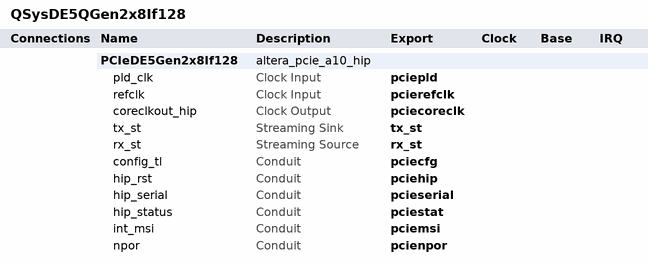
[diagram p0: system contents]
# Platform Designer (Qsys) system QSysDE5QGen2x8If128, Arria 10 10AX115N2F45E1SG
# Parameters at their usual value, and those the tool derives, are not listed.
package require -exact qsys 17.0
create_system QSysDE5QGen2x8If128
set_project_property DEVICE_FAMILY {Arria 10}
set_project_property DEVICE 10AX115N2F45E1SG

add_instance PCIeDE5Gen2x8If128 altera_pcie_a10_hip 17.0
set_instance_parameter_value PCIeDE5Gen2x8If128 adme_enable_hwtcl 0
set_instance_parameter_value PCIeDE5Gen2x8If128 advance_error_reporting_hwtcl 0
set_instance_parameter_value PCIeDE5Gen2x8If128 apps_type_hwtcl 0
set_instance_parameter_value PCIeDE5Gen2x8If128 ari_support_hwtcl 0
set_instance_parameter_value PCIeDE5Gen2x8If128 ast_trs_num_desc_hwtcl 16
set_instance_parameter_value PCIeDE5Gen2x8If128 ast_trs_rxdata_width_hwtcl 256
set_instance_parameter_value PCIeDE5Gen2x8If128 ast_trs_rxdesc_width_hwtcl 256
set_instance_parameter_value PCIeDE5Gen2x8If128 ast_trs_rxmty_width_hwtcl 32
set_instance_parameter_value PCIeDE5Gen2x8If128 ast_trs_txdata_width_hwtcl 256
set_instance_parameter_value PCIeDE5Gen2x8If128 ast_trs_txdesc_width_hwtcl 256
set_instance_parameter_value PCIeDE5Gen2x8If128 ast_trs_txmty_width_hwtcl 32
set_instance_parameter_value PCIeDE5Gen2x8If128 ast_trs_txstatus_width_hwtcl 256
set_instance_parameter_value PCIeDE5Gen2x8If128 avmm_addr_width_hwtcl 64
set_instance_parameter_value PCIeDE5Gen2x8If128 bar0_address_width_hwtcl 10
set_instance_parameter_value PCIeDE5Gen2x8If128 bar0_type_hwtcl {32-bit non-prefetchable memory}
set_instance_parameter_value PCIeDE5Gen2x8If128 bar1_address_width_hwtcl 0
set_instance_parameter_value PCIeDE5Gen2x8If128 bar1_type_hwtcl Disabled
set_instance_parameter_value PCIeDE5Gen2x8If128 bar2_address_width_hwtcl 8
set_instance_parameter_value PCIeDE5Gen2x8If128 bar2_type_hwtcl {64-bit prefetchable memory}
set_instance_parameter_value PCIeDE5Gen2x8If128 bar3_address_width_hwtcl 0
set_instance_parameter_value PCIeDE5Gen2x8If128 bar3_type_hwtcl Disabled
set_instance_parameter_value PCIeDE5Gen2x8If128 base_device NIGHTFURY5
set_instance_parameter_value PCIeDE5Gen2x8If128 bfm_drive_interface_clk_hwtcl 1
set_instance_parameter_value PCIeDE5Gen2x8If128 bfm_drive_interface_control_hwtcl 1
set_instance_parameter_value PCIeDE5Gen2x8If128 bfm_drive_interface_npor_hwtcl 1
set_instance_parameter_value PCIeDE5Gen2x8If128 bfm_drive_interface_pipe_hwtcl 1
set_instance_parameter_value PCIeDE5Gen2x8If128 cg_a2p_addr_map_pass_thru_bits_hwtcl 12
set_instance_parameter_value PCIeDE5Gen2x8If128 cg_enable_a2p_interrupt_hwtcl 0
set_instance_parameter_value PCIeDE5Gen2x8If128 cg_enable_advanced_interrupt_hwtcl 0
set_instance_parameter_value PCIeDE5Gen2x8If128 class_code_hwtcl 0
set_instance_parameter_value PCIeDE5Gen2x8If128 completion_timeout_hwtcl ABCD
set_instance_parameter_value PCIeDE5Gen2x8If128 cseb_autonomous_hwtcl 0
set_instance_parameter_value PCIeDE5Gen2x8If128 cseb_config_bypass_hwtcl 0
set_instance_parameter_value PCIeDE5Gen2x8If128 design_environment_hwtcl QSYS
set_instance_parameter_value PCIeDE5Gen2x8If128 devhide_support_hwtcl 0
set_instance_parameter_value PCIeDE5Gen2x8If128 device_embedded_ep_support_hwtcl 0
set_instance_parameter_value PCIeDE5Gen2x8If128 device_id_hwtcl 0
set_instance_parameter_value PCIeDE5Gen2x8If128 dis_adapt 0
set_instance_parameter_value PCIeDE5Gen2x8If128 dma_use_scfifo_ext_hwtcl 0
set_instance_parameter_value PCIeDE5Gen2x8If128 ecrc_check_capable_hwtcl 0
set_instance_parameter_value PCIeDE5Gen2x8If128 ecrc_gen_capable_hwtcl 0
set_instance_parameter_value PCIeDE5Gen2x8If128 enable_ast_trs_hwtcl 0
set_instance_parameter_value PCIeDE5Gen2x8If128 enable_avst_reset_hwtcl 0
set_instance_parameter_value PCIeDE5Gen2x8If128 enable_custom_features_hwtcl 0
set_instance_parameter_value PCIeDE5Gen2x8If128 enable_devkit_conduit_hwtcl 0
set_instance_parameter_value PCIeDE5Gen2x8If128 enable_example_design_qii_hwtcl 1
set_instance_parameter_value PCIeDE5Gen2x8If128 enable_example_design_sim_hwtcl 1
set_instance_parameter_value PCIeDE5Gen2x8If128 enable_example_design_synth_hwtcl 1
set_instance_parameter_value PCIeDE5Gen2x8If128 enable_example_design_tb_hwtcl 1
set_instance_parameter_value PCIeDE5Gen2x8If128 enable_gen3phase2eq_timechange 0
set_instance_parameter_value PCIeDE5Gen2x8If128 enable_hip_status_for_avmm_hwtcl 0
set_instance_parameter_value PCIeDE5Gen2x8If128 enable_lmi_hwtcl 1
set_instance_parameter_value PCIeDE5Gen2x8If128 enable_nobar_slection_hwtcl 0
set_instance_parameter_value PCIeDE5Gen2x8If128 enable_rxm_burst_hwtcl 0
set_instance_parameter_value PCIeDE5Gen2x8If128 enable_skp_det 0
set_instance_parameter_value PCIeDE5Gen2x8If128 enable_soft_dfe 0
set_instance_parameter_value PCIeDE5Gen2x8If128 export_fpll_output_to_top_level_hwtcl 0
set_instance_parameter_value PCIeDE5Gen2x8If128 export_phy_input_to_top_level_hwtcl 0
set_instance_parameter_value PCIeDE5Gen2x8If128 extended_tag_support_hwtcl 0
set_instance_parameter_value PCIeDE5Gen2x8If128 flr_capability_user_hwtcl 0
set_instance_parameter_value PCIeDE5Gen2x8If128 force_tag_checking_on_hwtcl 0
set_instance_parameter_value PCIeDE5Gen2x8If128 gen3_coeff_1_hwtcl 8
set_instance_parameter_value PCIeDE5Gen2x8If128 gen3_coeff_3_ber_meas_hwtcl 12ms
set_instance_parameter_value PCIeDE5Gen2x8If128 interface_type_hwtcl Avalon-ST
set_instance_parameter_value PCIeDE5Gen2x8If128 internal_controller_hwtcl 1
set_instance_parameter_value PCIeDE5Gen2x8If128 link2csr_width_hwtcl 16
set_instance_parameter_value PCIeDE5Gen2x8If128 maximum_payload_size_hwtcl 256
set_instance_parameter_value PCIeDE5Gen2x8If128 msi_multi_message_capable_hwtcl 1
set_instance_parameter_value PCIeDE5Gen2x8If128 part_trait_device 10AX115N2F45E1SG
set_instance_parameter_value PCIeDE5Gen2x8If128 pf0_ats_invalidate_queue_depth_hwtcl 0
set_instance_parameter_value PCIeDE5Gen2x8If128 pf0_bar0_prefetchable_hwtcl 1
set_instance_parameter_value PCIeDE5Gen2x8If128 pf0_bar0_present_hwtcl 1
set_instance_parameter_value PCIeDE5Gen2x8If128 pf0_bar0_size_hwtcl 12
set_instance_parameter_value PCIeDE5Gen2x8If128 pf0_bar0_type_hwtcl 1
set_instance_parameter_value PCIeDE5Gen2x8If128 pf0_bar1_prefetchable_hwtcl 1
set_instance_parameter_value PCIeDE5Gen2x8If128 pf0_bar1_present_hwtcl 0
set_instance_parameter_value PCIeDE5Gen2x8If128 pf0_bar1_size_hwtcl 12
set_instance_parameter_value PCIeDE5Gen2x8If128 pf0_bar2_prefetchable_hwtcl 1
set_instance_parameter_value PCIeDE5Gen2x8If128 pf0_bar2_present_hwtcl 0
set_instance_parameter_value PCIeDE5Gen2x8If128 pf0_bar2_size_hwtcl 12
set_instance_parameter_value PCIeDE5Gen2x8If128 pf0_bar2_type_hwtcl 1
set_instance_parameter_value PCIeDE5Gen2x8If128 pf0_bar3_prefetchable_hwtcl 1
set_instance_parameter_value PCIeDE5Gen2x8If128 pf0_bar3_present_hwtcl 0
set_instance_parameter_value PCIeDE5Gen2x8If128 pf0_bar3_size_hwtcl 12
set_instance_parameter_value PCIeDE5Gen2x8If128 pf0_bar4_prefetchable_hwtcl 1
set_instance_parameter_value PCIeDE5Gen2x8If128 pf0_bar4_present_hwtcl 0
set_instance_parameter_value PCIeDE5Gen2x8If128 pf0_bar4_size_hwtcl 12
set_instance_parameter_value PCIeDE5Gen2x8If128 pf0_bar4_type_hwtcl 1
set_instance_parameter_value PCIeDE5Gen2x8If128 pf0_bar5_prefetchable_hwtcl 1
set_instance_parameter_value PCIeDE5Gen2x8If128 pf0_bar5_present_hwtcl 0
set_instance_parameter_value PCIeDE5Gen2x8If128 pf0_bar5_size_hwtcl 12
set_instance_parameter_value PCIeDE5Gen2x8If128 pf0_exprom_bar_present_hwtcl 0
set_instance_parameter_value PCIeDE5Gen2x8If128 pf0_exprom_bar_size_hwtcl 12
set_instance_parameter_value PCIeDE5Gen2x8If128 pf0_extra_bar_present_hwtcl 0
set_instance_parameter_value PCIeDE5Gen2x8If128 pf0_extra_bar_size_hwtcl 12
set_instance_parameter_value PCIeDE5Gen2x8If128 pf0_interrupt_pin_hwtcl inta
set_instance_parameter_value PCIeDE5Gen2x8If128 pf0_intr_line_hwtcl 0
set_instance_parameter_value PCIeDE5Gen2x8If128 pf0_msi_multi_message_capable_hwtcl 4
set_instance_parameter_value PCIeDE5Gen2x8If128 pf0_msix_pba_bir_hwtcl 0
set_instance_parameter_value PCIeDE5Gen2x8If128 pf0_msix_pba_offset_hwtcl 0
set_instance_parameter_value PCIeDE5Gen2x8If128 pf0_msix_table_bir_hwtcl 0
set_instance_parameter_value PCIeDE5Gen2x8If128 pf0_msix_table_offset_hwtcl 0
set_instance_parameter_value PCIeDE5Gen2x8If128 pf0_msix_table_size_hwtcl 0
set_instance_parameter_value PCIeDE5Gen2x8If128 pf0_pci_prog_intfc_byte_hwtcl 0
set_instance_parameter_value PCIeDE5Gen2x8If128 pf0_subclass_code_hwtcl 0
set_instance_parameter_value PCIeDE5Gen2x8If128 pf0_tph_dev_specific_mode_support_hwtcl 0
set_instance_parameter_value PCIeDE5Gen2x8If128 pf0_tph_int_mode_support_hwtcl 0
set_instance_parameter_value PCIeDE5Gen2x8If128 pf0_tph_st_table_location_hwtcl 0
set_instance_parameter_value PCIeDE5Gen2x8If128 pf0_tph_st_table_size_hwtcl 63
set_instance_parameter_value PCIeDE5Gen2x8If128 pf0_vf_bar0_prefetchable_hwtcl 1
set_instance_parameter_value PCIeDE5Gen2x8If128 pf0_vf_bar0_present_hwtcl 0
set_instance_parameter_value PCIeDE5Gen2x8If128 pf0_vf_bar0_size_hwtcl 12
set_instance_parameter_value PCIeDE5Gen2x8If128 pf0_vf_bar0_type_hwtcl 1
set_instance_parameter_value PCIeDE5Gen2x8If128 pf0_vf_bar1_prefetchable_hwtcl 1
set_instance_parameter_value PCIeDE5Gen2x8If128 pf0_vf_bar1_present_hwtcl 0
set_instance_parameter_value PCIeDE5Gen2x8If128 pf0_vf_bar1_size_hwtcl 12
set_instance_parameter_value PCIeDE5Gen2x8If128 pf0_vf_bar2_prefetchable_hwtcl 1
set_instance_parameter_value PCIeDE5Gen2x8If128 pf0_vf_bar2_present_hwtcl 0
set_instance_parameter_value PCIeDE5Gen2x8If128 pf0_vf_bar2_size_hwtcl 12
set_instance_parameter_value PCIeDE5Gen2x8If128 pf0_vf_bar2_type_hwtcl 1
set_instance_parameter_value PCIeDE5Gen2x8If128 pf0_vf_bar3_prefetchable_hwtcl 1
set_instance_parameter_value PCIeDE5Gen2x8If128 pf0_vf_bar3_present_hwtcl 0
set_instance_parameter_value PCIeDE5Gen2x8If128 pf0_vf_bar3_size_hwtcl 12
set_instance_parameter_value PCIeDE5Gen2x8If128 pf0_vf_bar4_prefetchable_hwtcl 1
set_instance_parameter_value PCIeDE5Gen2x8If128 pf0_vf_bar4_present_hwtcl 0
set_instance_parameter_value PCIeDE5Gen2x8If128 pf0_vf_bar4_size_hwtcl 12
set_instance_parameter_value PCIeDE5Gen2x8If128 pf0_vf_bar4_type_hwtcl 1
set_instance_parameter_value PCIeDE5Gen2x8If128 pf0_vf_bar5_prefetchable_hwtcl 1
set_instance_parameter_value PCIeDE5Gen2x8If128 pf0_vf_bar5_present_hwtcl 0
set_instance_parameter_value PCIeDE5Gen2x8If128 pf0_vf_bar5_size_hwtcl 12
set_instance_parameter_value PCIeDE5Gen2x8If128 pf0_vf_count_user_hwtcl 0
set_instance_parameter_value PCIeDE5Gen2x8If128 pf0_vf_device_id_hwtcl 0
set_instance_parameter_value PCIeDE5Gen2x8If128 pf0_vf_msix_pba_bir_hwtcl 0
set_instance_parameter_value PCIeDE5Gen2x8If128 pf0_vf_msix_pba_offset_hwtcl 0
set_instance_parameter_value PCIeDE5Gen2x8If128 pf0_vf_msix_tbl_bir_hwtcl 0
set_instance_parameter_value PCIeDE5Gen2x8If128 pf0_vf_msix_tbl_offset_hwtcl 0
set_instance_parameter_value PCIeDE5Gen2x8If128 pf0_vf_msix_tbl_size_hwtcl 0
set_instance_parameter_value PCIeDE5Gen2x8If128 pf0_vf_tph_dev_specific_mode_support_hwtcl 0
set_instance_parameter_value PCIeDE5Gen2x8If128 pf0_vf_tph_int_mode_support_hwtcl 0
set_instance_parameter_value PCIeDE5Gen2x8If128 pf0_vf_tph_st_table_location_hwtcl 0
set_instance_parameter_value PCIeDE5Gen2x8If128 pf0_vf_tph_st_table_size_hwtcl 63
set_instance_parameter_value PCIeDE5Gen2x8If128 pf1_ats_invalidate_queue_depth_hwtcl 0
set_instance_parameter_value PCIeDE5Gen2x8If128 pf1_bar0_prefetchable_hwtcl 1
set_instance_parameter_value PCIeDE5Gen2x8If128 pf1_bar0_present_hwtcl 0
set_instance_parameter_value PCIeDE5Gen2x8If128 pf1_bar0_size_hwtcl 12
set_instance_parameter_value PCIeDE5Gen2x8If128 pf1_bar0_type_hwtcl 1
set_instance_parameter_value PCIeDE5Gen2x8If128 pf1_bar1_prefetchable_hwtcl 1
set_instance_parameter_value PCIeDE5Gen2x8If128 pf1_bar1_present_hwtcl 0
set_instance_parameter_value PCIeDE5Gen2x8If128 pf1_bar1_size_hwtcl 12
set_instance_parameter_value PCIeDE5Gen2x8If128 pf1_bar2_prefetchable_hwtcl 1
set_instance_parameter_value PCIeDE5Gen2x8If128 pf1_bar2_present_hwtcl 0
set_instance_parameter_value PCIeDE5Gen2x8If128 pf1_bar2_size_hwtcl 12
set_instance_parameter_value PCIeDE5Gen2x8If128 pf1_bar2_type_hwtcl 1
set_instance_parameter_value PCIeDE5Gen2x8If128 pf1_bar3_prefetchable_hwtcl 1
set_instance_parameter_value PCIeDE5Gen2x8If128 pf1_bar3_present_hwtcl 0
set_instance_parameter_value PCIeDE5Gen2x8If128 pf1_bar3_size_hwtcl 12
set_instance_parameter_value PCIeDE5Gen2x8If128 pf1_bar4_prefetchable_hwtcl 1
set_instance_parameter_value PCIeDE5Gen2x8If128 pf1_bar4_present_hwtcl 0
set_instance_parameter_value PCIeDE5Gen2x8If128 pf1_bar4_size_hwtcl 12
set_instance_parameter_value PCIeDE5Gen2x8If128 pf1_bar4_type_hwtcl 1
set_instance_parameter_value PCIeDE5Gen2x8If128 pf1_bar5_prefetchable_hwtcl 1
set_instance_parameter_value PCIeDE5Gen2x8If128 pf1_bar5_present_hwtcl 0
set_instance_parameter_value PCIeDE5Gen2x8If128 pf1_bar5_size_hwtcl 12
set_instance_parameter_value PCIeDE5Gen2x8If128 pf1_class_code_hwtcl 0
set_instance_parameter_value PCIeDE5Gen2x8If128 pf1_device_id_hwtcl 0
set_instance_parameter_value PCIeDE5Gen2x8If128 pf1_exprom_bar_present_hwtcl 0
set_instance_parameter_value PCIeDE5Gen2x8If128 pf1_exprom_bar_size_hwtcl 12
set_instance_parameter_value PCIeDE5Gen2x8If128 pf1_interrupt_pin_hwtcl inta
set_instance_parameter_value PCIeDE5Gen2x8If128 pf1_intr_line_hwtcl 0
set_instance_parameter_value PCIeDE5Gen2x8If128 pf1_msi_multi_message_capable_hwtcl 4
set_instance_parameter_value PCIeDE5Gen2x8If128 pf1_msix_pba_bir_hwtcl 0
set_instance_parameter_value PCIeDE5Gen2x8If128 pf1_msix_pba_offset_hwtcl 0
set_instance_parameter_value PCIeDE5Gen2x8If128 pf1_msix_table_bir_hwtcl 0
set_instance_parameter_value PCIeDE5Gen2x8If128 pf1_msix_table_offset_hwtcl 0
set_instance_parameter_value PCIeDE5Gen2x8If128 pf1_msix_table_size_hwtcl 0
set_instance_parameter_value PCIeDE5Gen2x8If128 pf1_pci_prog_intfc_byte_hwtcl 0
set_instance_parameter_value PCIeDE5Gen2x8If128 pf1_revision_id_hwtcl 0
set_instance_parameter_value PCIeDE5Gen2x8If128 pf1_subclass_code_hwtcl 0
set_instance_parameter_value PCIeDE5Gen2x8If128 pf1_subsystem_device_id_hwtcl 0
set_instance_parameter_value PCIeDE5Gen2x8If128 pf1_subsystem_vendor_id_hwtcl 0
set_instance_parameter_value PCIeDE5Gen2x8If128 pf1_tph_dev_specific_mode_support_hwtcl 0
set_instance_parameter_value PCIeDE5Gen2x8If128 pf1_tph_int_mode_support_hwtcl 0
set_instance_parameter_value PCIeDE5Gen2x8If128 pf1_tph_st_table_location_hwtcl 0
set_instance_parameter_value PCIeDE5Gen2x8If128 pf1_tph_st_table_size_hwtcl 63
set_instance_parameter_value PCIeDE5Gen2x8If128 pf1_vendor_id_hwtcl 0
set_instance_parameter_value PCIeDE5Gen2x8If128 pf1_vf_bar0_prefetchable_hwtcl 1
set_instance_parameter_value PCIeDE5Gen2x8If128 pf1_vf_bar0_present_hwtcl 0
set_instance_parameter_value PCIeDE5Gen2x8If128 pf1_vf_bar0_size_hwtcl 12
set_instance_parameter_value PCIeDE5Gen2x8If128 pf1_vf_bar0_type_hwtcl 1
set_instance_parameter_value PCIeDE5Gen2x8If128 pf1_vf_bar1_prefetchable_hwtcl 1
set_instance_parameter_value PCIeDE5Gen2x8If128 pf1_vf_bar1_present_hwtcl 0
set_instance_parameter_value PCIeDE5Gen2x8If128 pf1_vf_bar1_size_hwtcl 12
set_instance_parameter_value PCIeDE5Gen2x8If128 pf1_vf_bar2_prefetchable_hwtcl 1
set_instance_parameter_value PCIeDE5Gen2x8If128 pf1_vf_bar2_present_hwtcl 0
set_instance_parameter_value PCIeDE5Gen2x8If128 pf1_vf_bar2_size_hwtcl 12
set_instance_parameter_value PCIeDE5Gen2x8If128 pf1_vf_bar2_type_hwtcl 1
set_instance_parameter_value PCIeDE5Gen2x8If128 pf1_vf_bar3_prefetchable_hwtcl 1
set_instance_parameter_value PCIeDE5Gen2x8If128 pf1_vf_bar3_present_hwtcl 0
set_instance_parameter_value PCIeDE5Gen2x8If128 pf1_vf_bar3_size_hwtcl 12
set_instance_parameter_value PCIeDE5Gen2x8If128 pf1_vf_bar4_prefetchable_hwtcl 1
set_instance_parameter_value PCIeDE5Gen2x8If128 pf1_vf_bar4_present_hwtcl 0
set_instance_parameter_value PCIeDE5Gen2x8If128 pf1_vf_bar4_size_hwtcl 12
set_instance_parameter_value PCIeDE5Gen2x8If128 pf1_vf_bar4_type_hwtcl 1
set_instance_parameter_value PCIeDE5Gen2x8If128 pf1_vf_bar5_prefetchable_hwtcl 1
set_instance_parameter_value PCIeDE5Gen2x8If128 pf1_vf_bar5_present_hwtcl 0
set_instance_parameter_value PCIeDE5Gen2x8If128 pf1_vf_bar5_size_hwtcl 12
set_instance_parameter_value PCIeDE5Gen2x8If128 pf1_vf_count_user_hwtcl 0
set_instance_parameter_value PCIeDE5Gen2x8If128 pf1_vf_device_id_hwtcl 0
set_instance_parameter_value PCIeDE5Gen2x8If128 pf1_vf_msix_pba_bir_hwtcl 0
set_instance_parameter_value PCIeDE5Gen2x8If128 pf1_vf_msix_pba_offset_hwtcl 0
set_instance_parameter_value PCIeDE5Gen2x8If128 pf1_vf_msix_tbl_bir_hwtcl 0
set_instance_parameter_value PCIeDE5Gen2x8If128 pf1_vf_msix_tbl_offset_hwtcl 0
set_instance_parameter_value PCIeDE5Gen2x8If128 pf1_vf_msix_tbl_size_hwtcl 0
set_instance_parameter_value PCIeDE5Gen2x8If128 pf1_vf_tph_dev_specific_mode_support_hwtcl 0
set_instance_parameter_value PCIeDE5Gen2x8If128 pf1_vf_tph_int_mode_support_hwtcl 0
set_instance_parameter_value PCIeDE5Gen2x8If128 pf1_vf_tph_st_table_location_hwtcl 0
set_instance_parameter_value PCIeDE5Gen2x8If128 pf1_vf_tph_st_table_size_hwtcl 63
set_instance_parameter_value PCIeDE5Gen2x8If128 pf2_ats_invalidate_queue_depth_hwtcl 0
set_instance_parameter_value PCIeDE5Gen2x8If128 pf2_bar0_prefetchable_hwtcl 1
set_instance_parameter_value PCIeDE5Gen2x8If128 pf2_bar0_present_hwtcl 0
set_instance_parameter_value PCIeDE5Gen2x8If128 pf2_bar0_size_hwtcl 12
set_instance_parameter_value PCIeDE5Gen2x8If128 pf2_bar0_type_hwtcl 1
set_instance_parameter_value PCIeDE5Gen2x8If128 pf2_bar1_prefetchable_hwtcl 1
set_instance_parameter_value PCIeDE5Gen2x8If128 pf2_bar1_present_hwtcl 0
set_instance_parameter_value PCIeDE5Gen2x8If128 pf2_bar1_size_hwtcl 12
set_instance_parameter_value PCIeDE5Gen2x8If128 pf2_bar2_prefetchable_hwtcl 1
set_instance_parameter_value PCIeDE5Gen2x8If128 pf2_bar2_present_hwtcl 0
set_instance_parameter_value PCIeDE5Gen2x8If128 pf2_bar2_size_hwtcl 12
set_instance_parameter_value PCIeDE5Gen2x8If128 pf2_bar2_type_hwtcl 1
set_instance_parameter_value PCIeDE5Gen2x8If128 pf2_bar3_prefetchable_hwtcl 1
set_instance_parameter_value PCIeDE5Gen2x8If128 pf2_bar3_present_hwtcl 0
set_instance_parameter_value PCIeDE5Gen2x8If128 pf2_bar3_size_hwtcl 12
set_instance_parameter_value PCIeDE5Gen2x8If128 pf2_bar4_prefetchable_hwtcl 1
set_instance_parameter_value PCIeDE5Gen2x8If128 pf2_bar4_present_hwtcl 0
set_instance_parameter_value PCIeDE5Gen2x8If128 pf2_bar4_size_hwtcl 12
set_instance_parameter_value PCIeDE5Gen2x8If128 pf2_bar4_type_hwtcl 1
set_instance_parameter_value PCIeDE5Gen2x8If128 pf2_bar5_prefetchable_hwtcl 1
set_instance_parameter_value PCIeDE5Gen2x8If128 pf2_bar5_present_hwtcl 0
set_instance_parameter_value PCIeDE5Gen2x8If128 pf2_bar5_size_hwtcl 12
set_instance_parameter_value PCIeDE5Gen2x8If128 pf2_class_code_hwtcl 0
set_instance_parameter_value PCIeDE5Gen2x8If128 pf2_device_id_hwtcl 0
set_instance_parameter_value PCIeDE5Gen2x8If128 pf2_exprom_bar_present_hwtcl 0
set_instance_parameter_value PCIeDE5Gen2x8If128 pf2_exprom_bar_size_hwtcl 12
set_instance_parameter_value PCIeDE5Gen2x8If128 pf2_interrupt_pin_hwtcl inta
set_instance_parameter_value PCIeDE5Gen2x8If128 pf2_intr_line_hwtcl 0
set_instance_parameter_value PCIeDE5Gen2x8If128 pf2_msi_multi_message_capable_hwtcl 4
set_instance_parameter_value PCIeDE5Gen2x8If128 pf2_msix_pba_bir_hwtcl 0
set_instance_parameter_value PCIeDE5Gen2x8If128 pf2_msix_pba_offset_hwtcl 0
set_instance_parameter_value PCIeDE5Gen2x8If128 pf2_msix_table_bir_hwtcl 0
set_instance_parameter_value PCIeDE5Gen2x8If128 pf2_msix_table_offset_hwtcl 0
set_instance_parameter_value PCIeDE5Gen2x8If128 pf2_msix_table_size_hwtcl 0
set_instance_parameter_value PCIeDE5Gen2x8If128 pf2_pci_prog_intfc_byte_hwtcl 0
set_instance_parameter_value PCIeDE5Gen2x8If128 pf2_revision_id_hwtcl 0
set_instance_parameter_value PCIeDE5Gen2x8If128 pf2_subclass_code_hwtcl 0
set_instance_parameter_value PCIeDE5Gen2x8If128 pf2_subsystem_device_id_hwtcl 0
set_instance_parameter_value PCIeDE5Gen2x8If128 pf2_subsystem_vendor_id_hwtcl 0
set_instance_parameter_value PCIeDE5Gen2x8If128 pf2_tph_dev_specific_mode_support_hwtcl 0
set_instance_parameter_value PCIeDE5Gen2x8If128 pf2_tph_int_mode_support_hwtcl 0
set_instance_parameter_value PCIeDE5Gen2x8If128 pf2_tph_st_table_location_hwtcl 0
set_instance_parameter_value PCIeDE5Gen2x8If128 pf2_tph_st_table_size_hwtcl 63
set_instance_parameter_value PCIeDE5Gen2x8If128 pf2_vendor_id_hwtcl 0
set_instance_parameter_value PCIeDE5Gen2x8If128 pf2_vf_bar0_prefetchable_hwtcl 1
set_instance_parameter_value PCIeDE5Gen2x8If128 pf2_vf_bar0_present_hwtcl 0
set_instance_parameter_value PCIeDE5Gen2x8If128 pf2_vf_bar0_size_hwtcl 12
set_instance_parameter_value PCIeDE5Gen2x8If128 pf2_vf_bar0_type_hwtcl 1
set_instance_parameter_value PCIeDE5Gen2x8If128 pf2_vf_bar1_prefetchable_hwtcl 1
set_instance_parameter_value PCIeDE5Gen2x8If128 pf2_vf_bar1_present_hwtcl 0
set_instance_parameter_value PCIeDE5Gen2x8If128 pf2_vf_bar1_size_hwtcl 12
set_instance_parameter_value PCIeDE5Gen2x8If128 pf2_vf_bar2_prefetchable_hwtcl 1
set_instance_parameter_value PCIeDE5Gen2x8If128 pf2_vf_bar2_present_hwtcl 0
set_instance_parameter_value PCIeDE5Gen2x8If128 pf2_vf_bar2_size_hwtcl 12
set_instance_parameter_value PCIeDE5Gen2x8If128 pf2_vf_bar2_type_hwtcl 1
set_instance_parameter_value PCIeDE5Gen2x8If128 pf2_vf_bar3_prefetchable_hwtcl 1
set_instance_parameter_value PCIeDE5Gen2x8If128 pf2_vf_bar3_present_hwtcl 0
set_instance_parameter_value PCIeDE5Gen2x8If128 pf2_vf_bar3_size_hwtcl 12
set_instance_parameter_value PCIeDE5Gen2x8If128 pf2_vf_bar4_prefetchable_hwtcl 1
set_instance_parameter_value PCIeDE5Gen2x8If128 pf2_vf_bar4_present_hwtcl 0
set_instance_parameter_value PCIeDE5Gen2x8If128 pf2_vf_bar4_size_hwtcl 12
set_instance_parameter_value PCIeDE5Gen2x8If128 pf2_vf_bar4_type_hwtcl 1
set_instance_parameter_value PCIeDE5Gen2x8If128 pf2_vf_bar5_prefetchable_hwtcl 1
set_instance_parameter_value PCIeDE5Gen2x8If128 pf2_vf_bar5_present_hwtcl 0
set_instance_parameter_value PCIeDE5Gen2x8If128 pf2_vf_bar5_size_hwtcl 12
set_instance_parameter_value PCIeDE5Gen2x8If128 pf2_vf_count_user_hwtcl 0
set_instance_parameter_value PCIeDE5Gen2x8If128 pf2_vf_device_id_hwtcl 0
set_instance_parameter_value PCIeDE5Gen2x8If128 pf2_vf_msix_pba_bir_hwtcl 0
set_instance_parameter_value PCIeDE5Gen2x8If128 pf2_vf_msix_pba_offset_hwtcl 0
set_instance_parameter_value PCIeDE5Gen2x8If128 pf2_vf_msix_tbl_bir_hwtcl 0
set_instance_parameter_value PCIeDE5Gen2x8If128 pf2_vf_msix_tbl_offset_hwtcl 0
set_instance_parameter_value PCIeDE5Gen2x8If128 pf2_vf_msix_tbl_size_hwtcl 0
set_instance_parameter_value PCIeDE5Gen2x8If128 pf2_vf_tph_dev_specific_mode_support_hwtcl 0
set_instance_parameter_value PCIeDE5Gen2x8If128 pf2_vf_tph_int_mode_support_hwtcl 0
set_instance_parameter_value PCIeDE5Gen2x8If128 pf2_vf_tph_st_table_location_hwtcl 0
set_instance_parameter_value PCIeDE5Gen2x8If128 pf2_vf_tph_st_table_size_hwtcl 63
set_instance_parameter_value PCIeDE5Gen2x8If128 pf3_ats_invalidate_queue_depth_hwtcl 0
set_instance_parameter_value PCIeDE5Gen2x8If128 pf3_bar0_prefetchable_hwtcl 1
set_instance_parameter_value PCIeDE5Gen2x8If128 pf3_bar0_present_hwtcl 0
set_instance_parameter_value PCIeDE5Gen2x8If128 pf3_bar0_size_hwtcl 12
set_instance_parameter_value PCIeDE5Gen2x8If128 pf3_bar0_type_hwtcl 1
set_instance_parameter_value PCIeDE5Gen2x8If128 pf3_bar1_prefetchable_hwtcl 1
set_instance_parameter_value PCIeDE5Gen2x8If128 pf3_bar1_present_hwtcl 0
set_instance_parameter_value PCIeDE5Gen2x8If128 pf3_bar1_size_hwtcl 12
set_instance_parameter_value PCIeDE5Gen2x8If128 pf3_bar2_prefetchable_hwtcl 1
set_instance_parameter_value PCIeDE5Gen2x8If128 pf3_bar2_present_hwtcl 0
set_instance_parameter_value PCIeDE5Gen2x8If128 pf3_bar2_size_hwtcl 12
set_instance_parameter_value PCIeDE5Gen2x8If128 pf3_bar2_type_hwtcl 1
set_instance_parameter_value PCIeDE5Gen2x8If128 pf3_bar3_prefetchable_hwtcl 1
set_instance_parameter_value PCIeDE5Gen2x8If128 pf3_bar3_present_hwtcl 0
set_instance_parameter_value PCIeDE5Gen2x8If128 pf3_bar3_size_hwtcl 12
set_instance_parameter_value PCIeDE5Gen2x8If128 pf3_bar4_prefetchable_hwtcl 1
set_instance_parameter_value PCIeDE5Gen2x8If128 pf3_bar4_present_hwtcl 0
set_instance_parameter_value PCIeDE5Gen2x8If128 pf3_bar4_size_hwtcl 12
set_instance_parameter_value PCIeDE5Gen2x8If128 pf3_bar4_type_hwtcl 1
set_instance_parameter_value PCIeDE5Gen2x8If128 pf3_bar5_prefetchable_hwtcl 1
set_instance_parameter_value PCIeDE5Gen2x8If128 pf3_bar5_present_hwtcl 0
set_instance_parameter_value PCIeDE5Gen2x8If128 pf3_bar5_size_hwtcl 12
set_instance_parameter_value PCIeDE5Gen2x8If128 pf3_class_code_hwtcl 0
set_instance_parameter_value PCIeDE5Gen2x8If128 pf3_device_id_hwtcl 0
set_instance_parameter_value PCIeDE5Gen2x8If128 pf3_exprom_bar_present_hwtcl 0
set_instance_parameter_value PCIeDE5Gen2x8If128 pf3_exprom_bar_size_hwtcl 12
set_instance_parameter_value PCIeDE5Gen2x8If128 pf3_interrupt_pin_hwtcl inta
set_instance_parameter_value PCIeDE5Gen2x8If128 pf3_intr_line_hwtcl 0
set_instance_parameter_value PCIeDE5Gen2x8If128 pf3_msi_multi_message_capable_hwtcl 4
set_instance_parameter_value PCIeDE5Gen2x8If128 pf3_msix_pba_bir_hwtcl 0
set_instance_parameter_value PCIeDE5Gen2x8If128 pf3_msix_pba_offset_hwtcl 0
set_instance_parameter_value PCIeDE5Gen2x8If128 pf3_msix_table_bir_hwtcl 0
set_instance_parameter_value PCIeDE5Gen2x8If128 pf3_msix_table_offset_hwtcl 0
set_instance_parameter_value PCIeDE5Gen2x8If128 pf3_msix_table_size_hwtcl 0
set_instance_parameter_value PCIeDE5Gen2x8If128 pf3_pci_prog_intfc_byte_hwtcl 0
set_instance_parameter_value PCIeDE5Gen2x8If128 pf3_revision_id_hwtcl 0
set_instance_parameter_value PCIeDE5Gen2x8If128 pf3_subclass_code_hwtcl 0
set_instance_parameter_value PCIeDE5Gen2x8If128 pf3_subsystem_device_id_hwtcl 0
set_instance_parameter_value PCIeDE5Gen2x8If128 pf3_subsystem_vendor_id_hwtcl 0
set_instance_parameter_value PCIeDE5Gen2x8If128 pf3_tph_dev_specific_mode_support_hwtcl 0
set_instance_parameter_value PCIeDE5Gen2x8If128 pf3_tph_int_mode_support_hwtcl 0
set_instance_parameter_value PCIeDE5Gen2x8If128 pf3_tph_st_table_location_hwtcl 0
set_instance_parameter_value PCIeDE5Gen2x8If128 pf3_tph_st_table_size_hwtcl 63
set_instance_parameter_value PCIeDE5Gen2x8If128 pf3_vendor_id_hwtcl 0
set_instance_parameter_value PCIeDE5Gen2x8If128 pf3_vf_bar0_prefetchable_hwtcl 1
set_instance_parameter_value PCIeDE5Gen2x8If128 pf3_vf_bar0_present_hwtcl 0
set_instance_parameter_value PCIeDE5Gen2x8If128 pf3_vf_bar0_size_hwtcl 12
set_instance_parameter_value PCIeDE5Gen2x8If128 pf3_vf_bar0_type_hwtcl 1
set_instance_parameter_value PCIeDE5Gen2x8If128 pf3_vf_bar1_prefetchable_hwtcl 1
set_instance_parameter_value PCIeDE5Gen2x8If128 pf3_vf_bar1_present_hwtcl 0
set_instance_parameter_value PCIeDE5Gen2x8If128 pf3_vf_bar1_size_hwtcl 12
set_instance_parameter_value PCIeDE5Gen2x8If128 pf3_vf_bar2_prefetchable_hwtcl 1
set_instance_parameter_value PCIeDE5Gen2x8If128 pf3_vf_bar2_present_hwtcl 0
set_instance_parameter_value PCIeDE5Gen2x8If128 pf3_vf_bar2_size_hwtcl 12
set_instance_parameter_value PCIeDE5Gen2x8If128 pf3_vf_bar2_type_hwtcl 1
set_instance_parameter_value PCIeDE5Gen2x8If128 pf3_vf_bar3_prefetchable_hwtcl 1
set_instance_parameter_value PCIeDE5Gen2x8If128 pf3_vf_bar3_present_hwtcl 0
set_instance_parameter_value PCIeDE5Gen2x8If128 pf3_vf_bar3_size_hwtcl 12
set_instance_parameter_value PCIeDE5Gen2x8If128 pf3_vf_bar4_prefetchable_hwtcl 1
set_instance_parameter_value PCIeDE5Gen2x8If128 pf3_vf_bar4_present_hwtcl 0
set_instance_parameter_value PCIeDE5Gen2x8If128 pf3_vf_bar4_size_hwtcl 12
set_instance_parameter_value PCIeDE5Gen2x8If128 pf3_vf_bar4_type_hwtcl 1
set_instance_parameter_value PCIeDE5Gen2x8If128 pf3_vf_bar5_prefetchable_hwtcl 1
set_instance_parameter_value PCIeDE5Gen2x8If128 pf3_vf_bar5_present_hwtcl 0
set_instance_parameter_value PCIeDE5Gen2x8If128 pf3_vf_bar5_size_hwtcl 12
set_instance_parameter_value PCIeDE5Gen2x8If128 pf3_vf_count_user_hwtcl 0
set_instance_parameter_value PCIeDE5Gen2x8If128 pf3_vf_device_id_hwtcl 0
set_instance_parameter_value PCIeDE5Gen2x8If128 pf3_vf_msix_pba_bir_hwtcl 0
set_instance_parameter_value PCIeDE5Gen2x8If128 pf3_vf_msix_pba_offset_hwtcl 0
set_instance_parameter_value PCIeDE5Gen2x8If128 pf3_vf_msix_tbl_bir_hwtcl 0
set_instance_parameter_value PCIeDE5Gen2x8If128 pf3_vf_msix_tbl_offset_hwtcl 0
set_instance_parameter_value PCIeDE5Gen2x8If128 pf3_vf_msix_tbl_size_hwtcl 0
set_instance_parameter_value PCIeDE5Gen2x8If128 pf3_vf_tph_dev_specific_mode_support_hwtcl 0
set_instance_parameter_value PCIeDE5Gen2x8If128 pf3_vf_tph_int_mode_support_hwtcl 0
set_instance_parameter_value PCIeDE5Gen2x8If128 pf3_vf_tph_st_table_location_hwtcl 0
set_instance_parameter_value PCIeDE5Gen2x8If128 pf3_vf_tph_st_table_size_hwtcl 63
set_instance_parameter_value PCIeDE5Gen2x8If128 pf_ats_support_hwtcl 0
set_instance_parameter_value PCIeDE5Gen2x8If128 pf_enable_function_msix_support_hwtcl 0
set_instance_parameter_value PCIeDE5Gen2x8If128 pf_msi_support_hwtcl 0
set_instance_parameter_value PCIeDE5Gen2x8If128 pf_tph_support_hwtcl 0
set_instance_parameter_value PCIeDE5Gen2x8If128 reserved_debug_hwtcl 0
set_instance_parameter_value PCIeDE5Gen2x8If128 revision_id_hwtcl 0
set_instance_parameter_value PCIeDE5Gen2x8If128 rx_buffer_credit_alloc_hwtcl Minimum
set_instance_parameter_value PCIeDE5Gen2x8If128 rx_cred_ctl_param_hwtcl 0
set_instance_parameter_value PCIeDE5Gen2x8If128 rx_polinv_soft_logic_enable 0
set_instance_parameter_value PCIeDE5Gen2x8If128 select_design_example_hwtcl PIO
set_instance_parameter_value PCIeDE5Gen2x8If128 select_design_example_rtl_lang_hwtcl Verilog
set_instance_parameter_value PCIeDE5Gen2x8If128 slave_address_map_0_hwtcl 0
set_instance_parameter_value PCIeDE5Gen2x8If128 slave_address_map_2_hprxm_hwtcl 0
set_instance_parameter_value PCIeDE5Gen2x8If128 slave_address_map_2_hwtcl 0
set_instance_parameter_value PCIeDE5Gen2x8If128 slot_clock_cfg_hwtcl 1
set_instance_parameter_value PCIeDE5Gen2x8If128 speed_change_hwtcl 0
set_instance_parameter_value PCIeDE5Gen2x8If128 sr_iov_support_hwtcl 0
set_instance_parameter_value PCIeDE5Gen2x8If128 sriov2_en 1
set_instance_parameter_value PCIeDE5Gen2x8If128 sriov2_exprom_en_hwtcl 0
set_instance_parameter_value PCIeDE5Gen2x8If128 subsystem_device_id_hwtcl 0
set_instance_parameter_value PCIeDE5Gen2x8If128 subsystem_vendor_id_hwtcl 0
set_instance_parameter_value PCIeDE5Gen2x8If128 system_page_sizes_supported_hwtcl 1363
set_instance_parameter_value PCIeDE5Gen2x8If128 targeted_devkit_hwtcl {Arria 10 GX FPGA Development Kit}
set_instance_parameter_value PCIeDE5Gen2x8If128 test_cseb_switch_hwtcl 0
set_instance_parameter_value PCIeDE5Gen2x8If128 tlp_insp_trg_dw0_hwtcl 2049
set_instance_parameter_value PCIeDE5Gen2x8If128 tlp_insp_trg_dw1_hwtcl 0
set_instance_parameter_value PCIeDE5Gen2x8If128 tlp_insp_trg_dw2_hwtcl 0
set_instance_parameter_value PCIeDE5Gen2x8If128 tlp_inspector_hwtcl 0
set_instance_parameter_value PCIeDE5Gen2x8If128 tlp_inspector_use_signal_probe_hwtcl 0
set_instance_parameter_value PCIeDE5Gen2x8If128 tlp_inspector_use_thin_rx_master 0
set_instance_parameter_value PCIeDE5Gen2x8If128 total_pf_count_hwtcl 1
set_instance_parameter_value PCIeDE5Gen2x8If128 use_dynamic_design_example_hwtcl 1
set_instance_parameter_value PCIeDE5Gen2x8If128 use_rpbfm_pro 0
set_instance_parameter_value PCIeDE5Gen2x8If128 user_id_hwtcl 0
set_instance_parameter_value PCIeDE5Gen2x8If128 user_txs_addr_width_hwtcl 22
set_instance_parameter_value PCIeDE5Gen2x8If128 vendor_id_hwtcl 4466
set_instance_parameter_value PCIeDE5Gen2x8If128 vf_ats_support_hwtcl 0
set_instance_parameter_value PCIeDE5Gen2x8If128 vf_msix_cap_present_hwtcl 0
set_instance_parameter_value PCIeDE5Gen2x8If128 vf_tph_support_hwtcl 0
set_instance_parameter_value PCIeDE5Gen2x8If128 vsec_cap_hwtcl 0
set_instance_parameter_value PCIeDE5Gen2x8If128 vsec_id_hwtcl 4466
set_instance_parameter_value PCIeDE5Gen2x8If128 wrala_hwtcl 7
set_instance_parameter_value PCIeDE5Gen2x8If128 xcvr_reconfig_hwtcl 0

# exported interfaces
add_interface pciecfg conduit end
set_interface_property pciecfg EXPORT_OF PCIeDE5Gen2x8If128.config_tl
add_interface pciecoreclk clock source
set_interface_property pciecoreclk EXPORT_OF PCIeDE5Gen2x8If128.coreclkout_hip
add_interface pciehip conduit end
set_interface_property pciehip EXPORT_OF PCIeDE5Gen2x8If128.hip_rst
add_interface pciemsi conduit end
set_interface_property pciemsi EXPORT_OF PCIeDE5Gen2x8If128.int_msi
add_interface pcienpor conduit end
set_interface_property pcienpor EXPORT_OF PCIeDE5Gen2x8If128.npor
add_interface pciepld clock sink
set_interface_property pciepld EXPORT_OF PCIeDE5Gen2x8If128.pld_clk
add_interface pcierefclk clock sink
set_interface_property pcierefclk EXPORT_OF PCIeDE5Gen2x8If128.refclk
add_interface pcieserial conduit end
set_interface_property pcieserial EXPORT_OF PCIeDE5Gen2x8If128.hip_serial
add_interface pciestat conduit end
set_interface_property pciestat EXPORT_OF PCIeDE5Gen2x8If128.hip_status
add_interface rx_st avalon_streaming source
set_interface_property rx_st EXPORT_OF PCIeDE5Gen2x8If128.rx_st
add_interface tx_st avalon_streaming sink
set_interface_property tx_st EXPORT_OF PCIeDE5Gen2x8If128.tx_st

set_interconnect_requirement {$system} qsys_mm.clockCrossingAdapter HANDSHAKE
set_interconnect_requirement {$system} qsys_mm.insertDefaultSlave false
set_interconnect_requirement {$system} qsys_mm.maxAdditionalLatency 1

save_system QSysDE5QGen2x8If128.qsys
